# Altium schematic sheet Alim_Ticketing_Slave.SchDoc
size A4; Organization: ETML-ES; Address1: Avenue Recordon 1; Address2: 1004 Lausanne; Address3: Switzerland
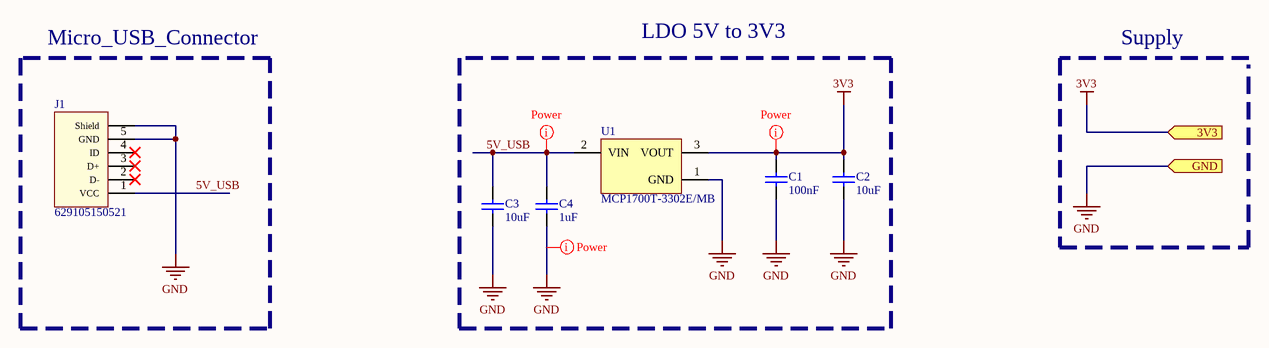
[diagram p0: Alim_Ticketing_Slave.SchDoc]

## Parts
C1  100nF  [6-0805_N]
C2  10uF  [6-0805_N]
C3  10uF  [6-0805_N]
C4  1uF  [6-0805_N]
J1  629105150521  [629105150521]
U1  MCP1700T-3302E/MB  [SOT-89-MB3_M]

## Blocks framed on the sheet
Micro_USB_Connector: J1
LDO 5V to 3V3: C1-C4 U1

## Ports
3V3, GND

## Nets
3V3: C1.2 C2.2 U1.3(VOUT) ; port 3V3
GND: C1.1 C2.1 C3.1 C4.1 J1.5(GND) J1.Shell(Shield) U1.1(GND) ; port GND
5V_USB: C3.2 C4.2 J1.1(VCC) U1.2(VIN)

Not connected (* = marked no-connect by the designer): J1 2(D-)* 3(D+)* 4(ID)*

## Layout directives
net class Power: 5V_USB
net class Undefined: 3V3, GND

## Notes on the sheet
- Supply
- Fichier :
- Date :
- Heure :
- Projet :
- Auteur :
- Version :
- Chemin :

## Library data of the parts
C1 = CMP-1036-04401-1: CAP 100nF 16V ±10% 0805 (2012 Metric) Thickness 1.45mm SMD; Case-Metric: 2012; Case-EIA: 0805; Tolerance: Â±10%; Max Thickness: 1.45 mm; Technology: SMT; Value: 100nF; Rated Voltage: 16 V
C2-C4 = CMP-1036-04930-1: CAP 10uF 16V ±20% 0805 (2012 Metric) Thickness 1mm SMD; Case-Metric: 2012; Case-EIA: 0805; Tolerance: Â±20%; Value: 10uF; Rated Voltage: 16 V; Technology: SMT; Max Thickness: 1 mm
J1 = 629105150521: Micro USB 2.0 SMT Type B Horizontal 5 Contacts High Current WR-COM; Interface Type: Type B; Gender: Receptacle; ComponentLink1Description: Manufacturer; ComponentLink1URL: http://www.we-online.de; ComponentLink2Description: Datasheet; ComponentLink2URL: http://katalog.we-online.de/em/datasheet/629105150521.pdf; Part Number: 629105150521; Published Date: April 2017; Publisher: Wurth Elektronik; Sub-Family: Micro USB 2.0; Type: Horizontal; Construction: SMT
U1 = CMP-0136-00812-1: Low Quiescent Current LDO, 3-Pin SOT-89, Extended Temperature, Tape and Reel; PackageDescription: 3-Lead Plastic Small Outline Transistor Header (MB) [SOT-89]; PackageReference: SOT-89-MB3; DatasheetVersion: revB, Feb-2007; Code_IPC: SOT89; PackageVersion: revBB, Aug-2009